# Altium schematic sheet LCD.SchDoc
size A4
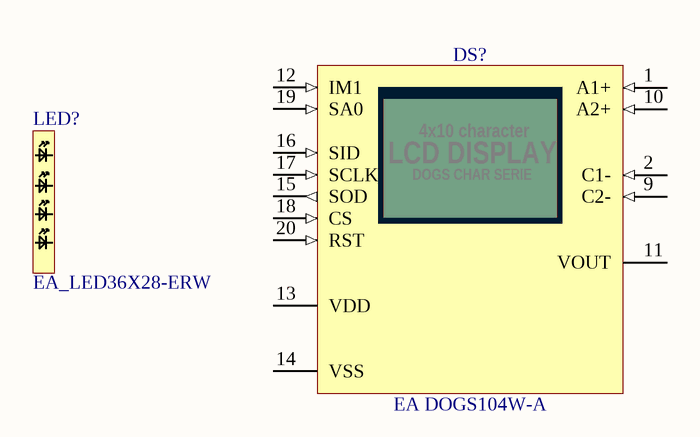
[diagram p0: LCD.SchDoc]

## Parts
DS?  EA DOGS104W-A  [DS_EA_DOGXL160B-7]
LED?  EA_LED36X28-ERW  [EA_LED36X28-ERW]

## Nets

Not connected (* = marked no-connect by the designer): DS? 1(A1+) 2(C1-) 9(C2-) 10(A2+) 11(VOUT) 12(IM1) 13(VDD) 14(VSS) 15(SOD) 16(SID) 17(SCLK) 18(CS) 19(SA0) 20(RST)

## Notes on the sheet
- (in symbol LCD_EA_DOGS104W-A) 4x10 character; LCD DISPLAY; DOGS CHAR SERIE

## Library data of the parts
DS? = LCD_EA_DOGS104W-A: 4x10   CHARACTER  LCD Display; Part Number: DS_EA_DOGS104W-A; Part Description: 4x10   CHARACTER  Display With Blue Background; Manufacturer: ELECTRONIC ASSEMBLY; Color: Blue; PressFit: No; Bonding: No; Component Kind: Standard; Component Type: Standard; Device: EA DOGS104W-A; Footprint: DS_EA_DOGS104W-A; PackageDescription: 4x10   CHARACTER  Display With Blue Background; Manufacturer Part Number: EA DOGS104W-A; Pin Count: 22; Mounted: Yes; Socket: No; SMD: No; Sense: No; ComponentHeight: 2.8mm; HelpURL: \\cern.ch\dfs\Applications\Altium\Datasheets\DS_EA_DOGXL160B-7.pdf; Author: CERN DEM JLC; CreateDate: 24.08.2011; LatestRevisionDate: 27.04.2011
LED? = LCD_EA_DOGS104_backlight